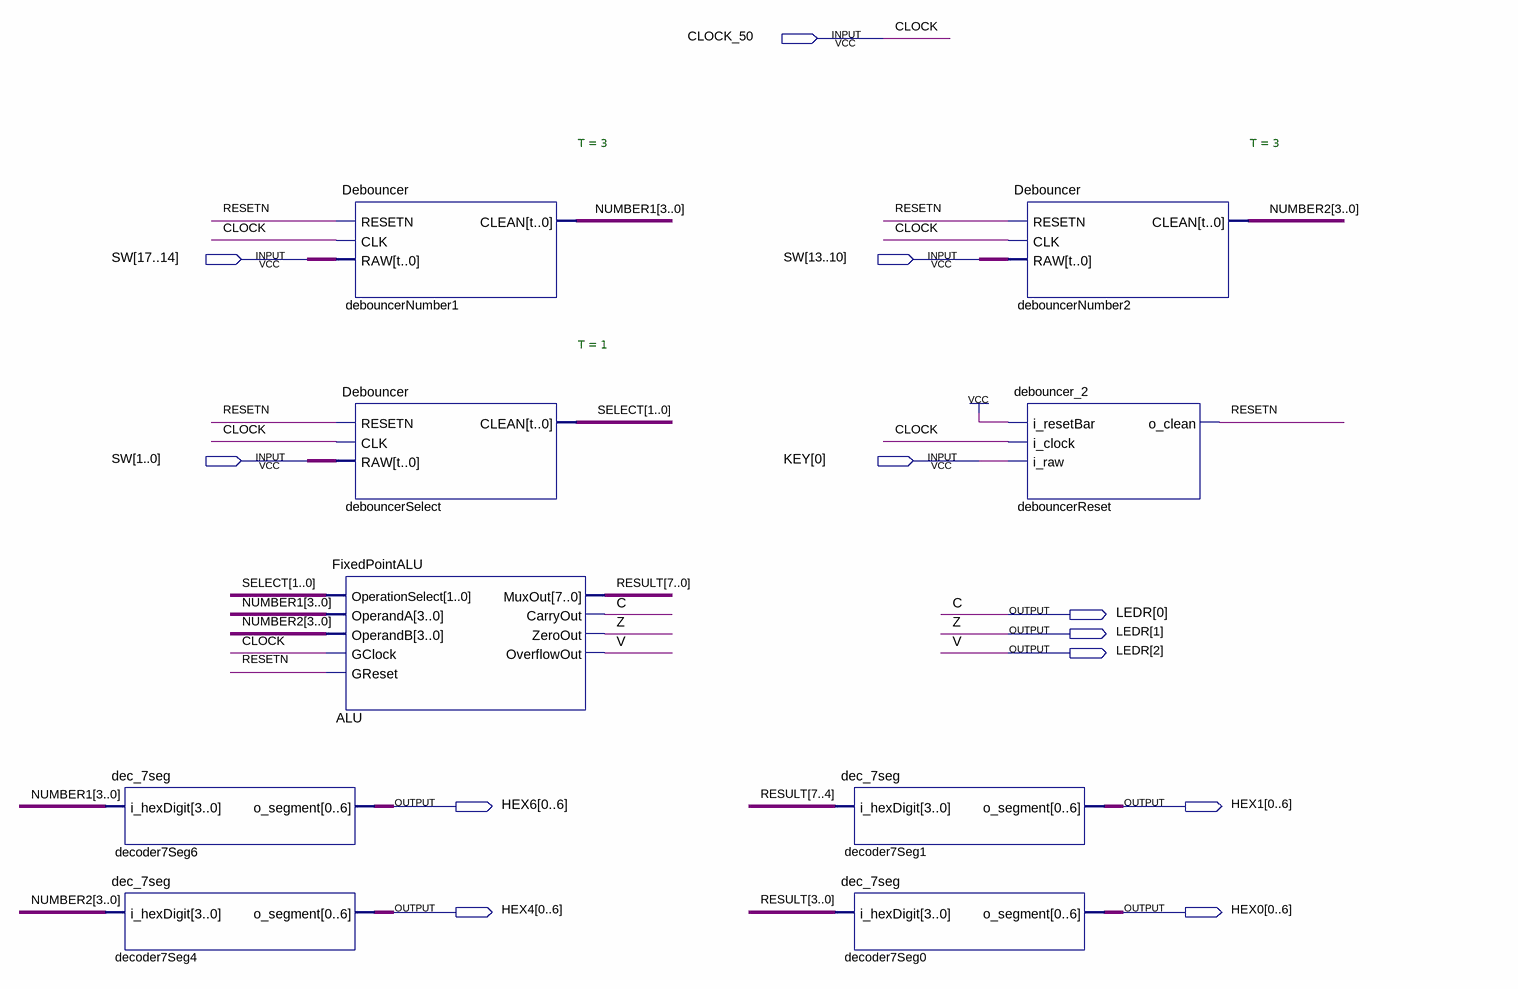
[diagram p0: schematic sheet]
// Quartus schematic Project.bdf as structural Verilog: 9 symbols, 12 pins
module Project (
  input  CLOCK_50,
  input  [17:0] SW,
  input  [0:0] KEY,
  output [2:0] LEDR,
  output [0:6] HEX6,
  output [0:6] HEX1,
  output [0:6] HEX4,
  output [0:6] HEX0
);

  wire RESETN;
  wire [1:0] SELECT;
  wire [3:0] NUMBER1, NUMBER2;
  wire [7:0] RESULT;

  dec_7seg decoder7Seg6 (.i_hexDigit(NUMBER1), .o_segment(HEX6));
  dec_7seg decoder7Seg4 (.i_hexDigit(NUMBER2), .o_segment(HEX4));
  Debouncer #(.T(3)) debouncerNumber1 (.RESETN(RESETN), .CLK(CLOCK_50), .RAW(SW[17:14]), .CLEAN(NUMBER1));
  Debouncer #(.T(1)) debouncerSelect (.RESETN(RESETN), .CLK(CLOCK_50), .RAW(SW[1:0]), .CLEAN(SELECT));
  FixedPointALU ALU (
    .OperationSelect(SELECT), .OperandA(NUMBER1), .OperandB(NUMBER2), .GClock(CLOCK_50), .GReset(RESETN),
    .MuxOut(RESULT), .CarryOut(LEDR[0]), .ZeroOut(LEDR[1]), .OverflowOut(LEDR[2]));
  dec_7seg decoder7Seg1 (.i_hexDigit(RESULT[7:4]), .o_segment(HEX1));
  dec_7seg decoder7Seg0 (.i_hexDigit(RESULT[3:0]), .o_segment(HEX0));
  Debouncer #(.T(3)) debouncerNumber2 (.RESETN(RESETN), .CLK(CLOCK_50), .RAW(SW[13:10]), .CLEAN(NUMBER2));
  debouncer_2 debouncerReset (.i_resetBar(1'b1), .i_clock(CLOCK_50), .i_raw(KEY[0]), .o_clean(RESETN));

  // Other names for the same wires on the sheet: C = LEDR[0]; CLOCK = CLOCK_50; V = LEDR[2]; Z = LEDR[1]
endmodule
